# Altium schematic sheet PS3_PMIC.SchDoc
size A3; SheetNumber: 3; SheetTotal: 20
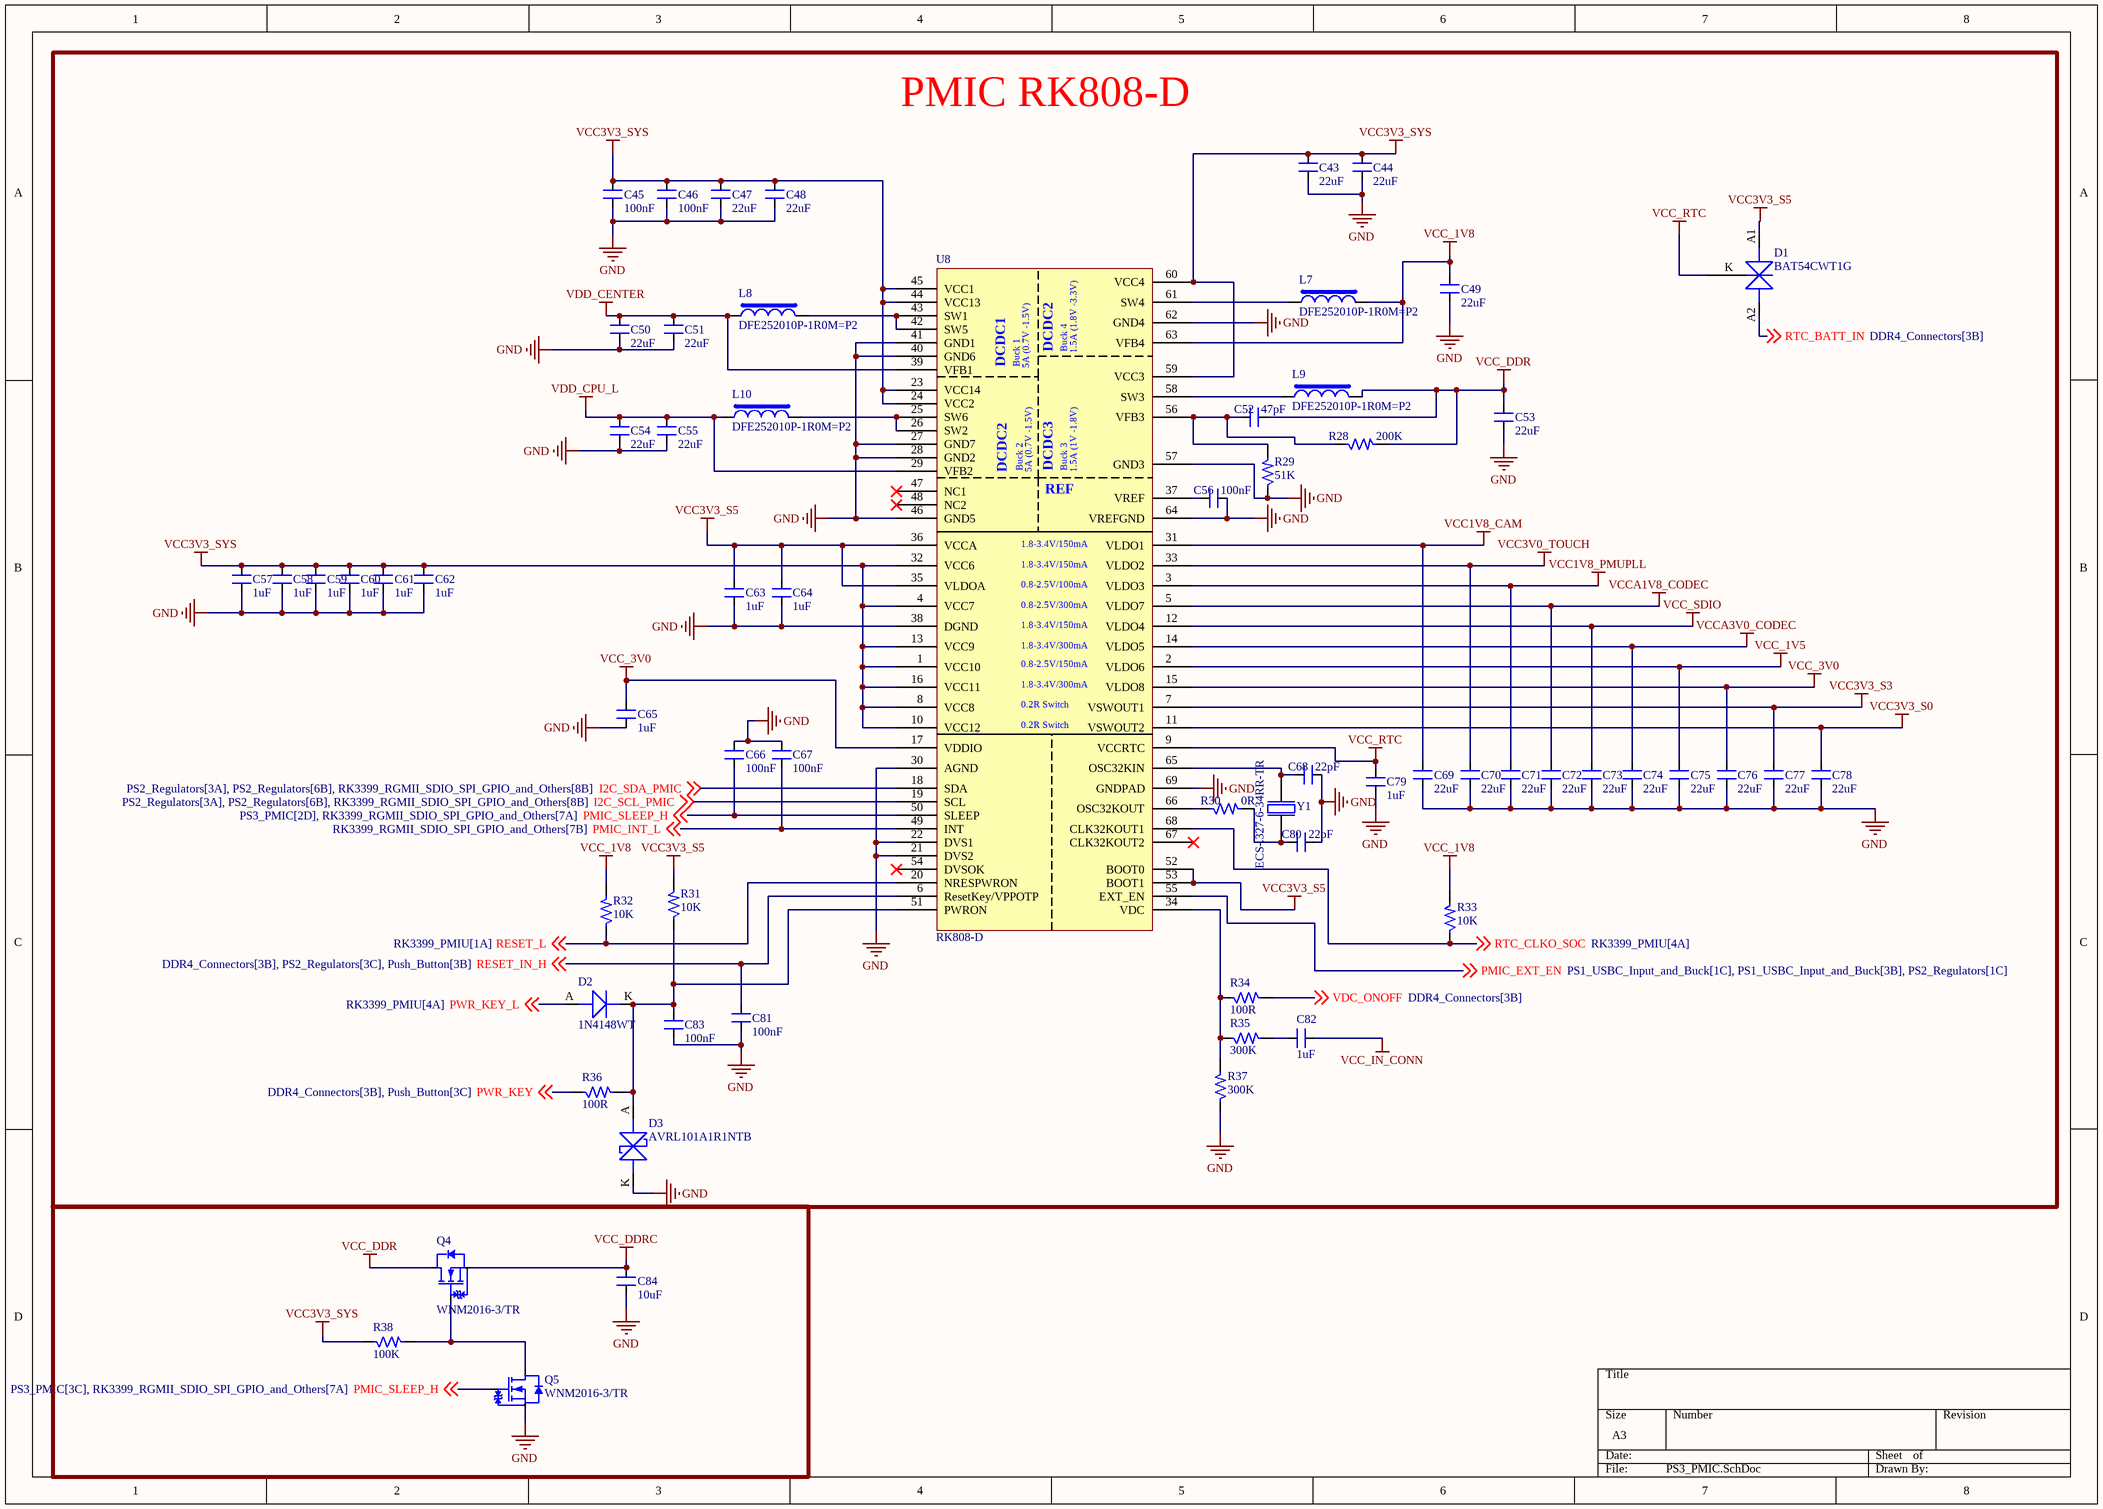
[diagram p0: PS3_PMIC.SchDoc]

## Parts
C43  22uF  [CAP_0603]
C44  22uF  [CAP_0603]
C45  100nF  [CAP_0402]
C46  100nF  [CAP_0402]
C47  22uF  [CAP_0603]
C48  22uF  [CAP_0603]
C49  22uF  [CAP_0603]
C50  22uF  [CAP_0603]
C51  22uF  [CAP_0603]
C52  47pF  [CAP_0402]
C53  22uF  [CAP_0603]
C54  22uF  [CAP_0603]
C55  22uF  [CAP_0603]
C56  100nF  [CAP_0402]
C57  1uF  [CAP_0402]
C58  1uF  [CAP_0402]
C59  1uF  [CAP_0402]
C60  1uF  [CAP_0402]
C61  1uF  [CAP_0402]
C62  1uF  [CAP_0402]
C63  1uF  [CAP_0402]
C64  1uF  [CAP_0402]
C65  1uF  [CAP_0402]
C66  100nF  [CAP_0402]
C67  100nF  [CAP_0402]
C68  22pF  [CAP_0402]
C69  22uF  [CAP_0603]
C70  22uF  [CAP_0603]
C71  22uF  [CAP_0603]
C72  22uF  [CAP_0603]
C73  22uF  [CAP_0603]
C74  22uF  [CAP_0603]
C75  22uF  [CAP_0603]
C76  22uF  [CAP_0603]
C77  22uF  [CAP_0603]
C78  22uF  [CAP_0603]
C79  1uF  [CAP_0402]
C80  22pF  [CAP_0402]
C81  100nF  [CAP_0402]
C82  1uF  [CAP_0402]
C83  100nF  [CAP_0402]
C84  10uF  [CAP_0402]
D1  BAT54CWT1G  [DIO_SOT-323-3]
D2  1N4148WT  [DIO_SOD523]
D3  AVRL101A1R1NTB  [DIO_0402_SMD]
L7  DFE252010P-1R0M=P2  [IND_1008]
L8  DFE252010P-1R0M=P2  [IND_1008]
L9  DFE252010P-1R0M=P2  [IND_1008]
L10  DFE252010P-1R0M=P2  [IND_1008]
Q4  WNM2016-3/TR  [SOT 23-3]
Q5  WNM2016-3/TR  [SOT 23-3]
R28  200K  [RES_0402]
R29  51K  [RES_0402]
R30  0R  [RES_0402]
R31  10K  [RES_0402]
R32  10K  [RES_0402]
R33  10K  [RES_0402]
R34  100R  [RES_0402]
R35  300K  [RES_0402]
R36  100R  [RES_0402]
R37  300K  [RES_0402]
R38  100K  [RES_0402]
U8  RK808-D  [QFN68_13.7_220.4X220.4_SMD]
Y1  ECS-.327-6-34RR-TR  [XTAL_ECS-.327-6-34RR-TR]

## Blocks framed on the sheet
PMIC RK808-D: C43-C83 D1-D3 L7-L10 R28-R37 U8 Y1

## Nets
GND: C43.1 C44.1 C45.1 C46.1 C47.1 C48.1 C49.1 C50.1 C51.1 C53.1 C54.1 C55.1 C56.2 C57.1 C58.1 C59.1 C60.1 C61.1 C62.1 C63.1 C64.1 C65.1 C66.2 C67.2 C68.2 C69.1 C70.1 C71.1 C72.1 C73.1 C74.1 C75.1 C76.1 C77.1 C78.1 C79.1 C80.2 C81.1 C83.1 C84.1 D3.K Q5.2(S) R29.1 R37.1 U8.21(DVS2) U8.22(DVS1) U8.27(GND7) U8.28(GND2) U8.30(AGND) U8.38(DGND) U8.40(GND6) U8.41(GND1) U8.46(GND5) U8.57(GND3) U8.62(GND4) U8.64(VREFGND) U8.69(GNDPAD)
VCC1V8_CAM: C69.2 U8.31(VLDO1)
VCC1V8_PMUPLL: C71.2 U8.3(VLDO3)
VCC3V0_TOUCH: C70.2 U8.33(VLDO2)
VCC3V3_S0: C78.2 U8.11(VSWOUT2)
VCC3V3_S3: C77.2 U8.7(VSWOUT1)
VCC3V3_S5: C63.2 C64.2 D1.A1 R31.2 U8.35(VLDOA) U8.36(VCCA) U8.52(BOOT0) U8.53(BOOT1)
VCC3V3_SYS: C43.2 C44.2 C45.2 C46.2 C47.2 C48.2 C57.2 C58.2 C59.2 C60.2 C61.2 C62.2 R38.1 U8.1(VCC10) U8.4(VCC7) U8.8(VCC8) U8.10(VCC12) U8.13(VCC9) U8.16(VCC11) U8.23(VCC14) U8.24(VCC2) U8.32(VCC6) U8.44(VCC13) U8.45(VCC1) U8.59(VCC3) U8.60(VCC4)
VCC_1V5: C75.2 U8.2(VLDO6)
VCC_1V8: C49.2 L7.2 R32.2 R33.2 U8.63(VFB4)
VCC_3V0: C65.2 C76.2 U8.15(VLDO8) U8.17(VDDIO)
VCC_DDR: C52.2 C53.2 L9.2 Q4.3(D) R28.2
VCC_DDRC: C84.2 Q4.2(S)
VCC_IN_CONN: C82.2
VCC_RTC: C79.2 D1.K U8.9(VCCRTC)
VCC_SDIO: C73.2 U8.12(VLDO4)
VCCA1V8_CODEC: C72.2 U8.5(VLDO7)
VCCA3V0_CODEC: C74.2 U8.14(VLDO5)
VDD_CENTER: C50.2 C51.2 L8.1 U8.39(VFB1)
VDD_CPU_L: C54.2 C55.2 L10.1 U8.29(VFB2)
I2C_SCL_PMIC: U8.19(SCL) ; off-sheet I2C_SCL_PMIC
I2C_SDA_PMIC: U8.18(SDA) ; off-sheet I2C_SDA_PMIC
PMIC_EXT_EN: U8.55(EXT_EN) ; off-sheet PMIC_EXT_EN
PMIC_INT_L: C67.1 U8.49(INT) ; off-sheet PMIC_INT_L
PMIC_SLEEP_H: C66.1 Q5.1(G) U8.50(SLEEP) ; off-sheet PMIC_SLEEP_H
PWR_KEY: R36.1 ; off-sheet PWR_KEY
PWR_KEY_L: D2.A(ANODE) ; off-sheet PWR_KEY_L
RESET_IN_H: C81.2 U8.6(ResetKey/VPPOTP) ; off-sheet RESET_IN_H
RESET_L: R32.1 U8.20(NRESPWRON) ; off-sheet RESET_L
RTC_BATT_IN: D1.A2 ; off-sheet RTC_BATT_IN
RTC_CLKO_SOC: R33.1 U8.68(CLK32KOUT1) ; off-sheet RTC_CLKO_SOC
VDC_ONOFF: R34.2 ; off-sheet VDC_ONOFF
NetC52_1: C52.1 R28.1 R29.2 U8.56(VFB3)
NetC56_1: C56.1 U8.37(VREF)
NetC68_1: C68.1 U8.65(OSC32KIN) Y1.2
NetC80_1: C80.1 R30.2 Y1.1
NetC82_1: C82.1 R35.2
NetC83_2: C83.2 D2.K(CATHODE) D3.A R31.1 R36.2 U8.51(PWRON)
NetL7_1: L7.1 U8.61(SW4)
NetL8_2: L8.2 U8.42(SW5) U8.43(SW1)
NetL9_1: L9.1 U8.58(SW3)
NetL10_2: L10.2 U8.25(SW6) U8.26(SW2)
NetQ4_1: Q4.1(G) Q5.3(D) R38.2
NetR30_1: R30.1 U8.66(OSC32KOUT)
NetR34_1: R34.1 R35.1 R37.2 U8.34(VDC)

Not connected (* = marked no-connect by the designer): U8 47(NC1)* 48(NC2)* 54(DVSOK)* 67(CLK32KOUT2)*

## Notes on the sheet
- (in symbol IC_RK808-D-QFN68) DCDC2; Buck 4; 1.5A (1.8V -3.3V); DCDC1; Buck 1; 5A (0.7V -1.5V); Buck 2; DCDC3; Buck 3; 1.5A (1V -1.8V); REF; 1.8-3.4V/150mA; 0.8-2.5V/100mA; 0.8-2.5V/300mA; 1.8-3.4V/300mA; 0.8-2.5V/150mA; 0.2R Switch

## Library data of the parts
C43 C44 C47-C51 C53-C55 C69-C78 = CAP_22uF-10V-20%-0603: 22µF ±20% 10V Ceramic Capacitor X5R 0603 (1608 Metric); Manufacturer: Murata Electronics; Manufacturer Part Number: GRM188R61A226ME15D; Case/Package: 0603; Supplier-1: Digikey
C45 C46 C56 C66 C67 C81 C83 = CAP_100nF-25V-10%-0402: 0.1µF ±10% 25V Ceramic Capacitor X7R 0402 (1005 Metric); Manufacturer: Walsin Technology Corporation; Manufacturer Part Number: 0402B104K250CT; Case/Package: 0402; Supplier-1: Digikey
C52 = CAP_47pF-10V-10%-0402: 47pF ±10% 10V Ceramic Capacitor C0G, NP0 0402 (1005 Metric); Manufacturer: KEMET; Manufacturer Part Number: C0402C470K8GAC7867; Case/Package: 0402; Supplier-1: Supplier-1
C57-C65 C79 C82 = CAP_1uF-16V-10%-0402: 1µF ±10% 16V Ceramic Capacitor X5R 0402 (1005 Metric); Manufacturer: Knowles Novacap; Manufacturer Part Number: 0402BW105K160YT; Case/Package: 0402; Supplier-1: Digikey
C68 C80 = CAP_22pF-10V-10%-0402: 22pF ±10% 10V Ceramic Capacitor C0G, NP0 0402 (1005 Metric); Manufacturer: KEMET; Manufacturer Part Number: C0402C220K8GACTU; Case/Package: 0402; Supplier-1: Digikey
C84 = CAP_10uF-10V-20%-0402: 10µF ±20% 10V Ceramic Capacitor X5R 0402 (1005 Metric); Manufacturer Part Number: CL05A106MP5NUNC; Manufacturer: Samsung Electro-Mechanics; Case/Package: 0402; Supplier-1: Digikey
D1 = DIO-S-A_30V-200mA-SOT-323: Diode Array 1 Pair Common Cathode Schottky 30V 200mA (DC) Surface Mount SC-70, SOT-323; Manufacturer: ON Semiconductor; Manufacturer Part Number: BAT54CWT1G; Case/Package: SOT323; Supplier-1: Digikey
D2 = DIO_75V-200mA-SOD-523F: Diode Standard 100V 300mA (DC) Surface Mount SOD-123; Manufacturer: FAIRCHILD; Manufacturer Part Number: 1N4148WT; Case/Package: SOD123; Supplier-1: SIRICOM
D3 = DIO-T_10V-39V-0402: 39V Varistor 1 Circuit Surface Mount, MLCV 0402 (1005 Metric); Manufacturer: TDK Corporation; Manufacturer Part Number: AVRL101A1R1NTB; Supplier-1: Digikey; Case/Package: 0402
L7-L10 = IND_1uH-3.8A-20%-1008: 1µH Shielded Wirewound Inductor 3.8A 54mOhm Max 1008 (2520 Metric); Manufacturer: Murata Electronics; Manufacturer Part Number: DFE252010P-1R0M=P2; Case/Package: 1008; Supplier-1: Digikey
Q4 Q5 = MOSFET-N_20V-2.9A-SOT-23: N Channel 20V 2.9A 1V @ 250uA 47mΩ @ 3.6A,4.5V 700mW SOT-23(SOT-23-3) MOSFET RoHS; Manufacturer: WILLSEMI(Will Semicon); Manufacturer Part Number: WNM2016-3/TR; Case/Package: SOT-23(SOT-23-3); Supplier-1: LCSC
R28 = RES_200K-0.1W-1%-0402: 200 kOhms ±1% 0.1W, 1/10W Chip Resistor 0402 (1005 Metric) Automotive AEC-Q200 Thick Film; Manufacturer: Panasonic Electronic Components; Manufacturer Part number: ERJ-2RKF2003X; Case/Package: 0402; Supplier-1: Digikey
R29 = RES_51K-0.1W-1%-0402: 51 kOhms ±1% 0.1W, 1/10W Chip Resistor 0402 (1005 Metric) Automotive AEC-Q200 Thick Film; Manufacturer: Panasonic Electronic Components; Manufacturer Part Number: ERJ-2RKF5102X; Case/Package: 0402; Supplier-1: Digikey
R30 = RES_0R-0.1W-1%-0402: 0 Ohms Jumper 0.1W, 1/10W Chip Resistor 0402 (1005 Metric) Automotive AEC-Q200 Thick Film; Manufacturer: Panasonic Electronic Components; Manufacturer Part Number: ERJ-2GE0R00X; Case/Package: 0402; Supplier-1: Digikey
R31-R33 = RES_10K-0.1W-1%-0402: 10 kOhms ±1% 0.1W, 1/10W Chip Resistor 0402 (1005 Metric) Anti-Sulfur Thin Film; Manufacturer: Vishay Beyschlag/Draloric/BC Components; Manufacturer Part Number: MCS04020C1002FE000; Case/Package: 0402; Supplier-1: Digikey
R34 R36 = RES_100R-0.1W-1%-0402: 100 Ohms ±1% 0.1W, 1/10W Chip Resistor 0402 (1005 Metric) Automotive AEC-Q200, Moisture Resistant Thick Film; Manufacturer: KOA Speer Electronics, Inc.; Manufacturer Part Number: RK73H1ETTP1000F; Case/Package: 0402; Supplier-1: Digikey
R35 R37 = RES_300K-0.1W-1%-0402: 300 kOhms ±1% 0.1W, 1/10W Chip Resistor 0402 (1005 Metric) Automotive AEC-Q200 Thick Film; Manufacturer: Panasonic Electronic Components; Manufacturer Part Number: ERJ-2RKF3003X; Case/Package: 0402; Supplier-1: Digikey
R38 = RES_100K-0.1W-1%-0402: 100 kOhms ±1% 0.1W, 1/10W Chip Resistor 0402 (1005 Metric) Anti-Sulfur Thin Film; Manufacturer: Vishay Beyschlag/Draloric/BC Components; Manufacturer Part Number: MCS04020C1003FE000; Case/Package: 0402; Supplier-1: Digikey
U8 = IC_RK808-D-QFN68: The RK808 is a complete power supply solution for Portable systems.; Manufacturer: Rockchip; Manufacturer Part Number: RK808-D; Case/Package: QFN68; Supplier-1: Rockchip
Y1 = XTAL_32.768Khz-22pF-SMD: 32.768kHz ±20ppm Crystal 12pF 80 kOhms 2-SMD, No Lead; Manufacturer: Ecliptek; Manufacturer Part Number: ECS-.327-6-34RR-TR; Case/Package: 0603; Supplier-1: Digikey